# Altium schematic sheet 27-JTAG BUFFER.SchDoc
size 513 x 386 mm
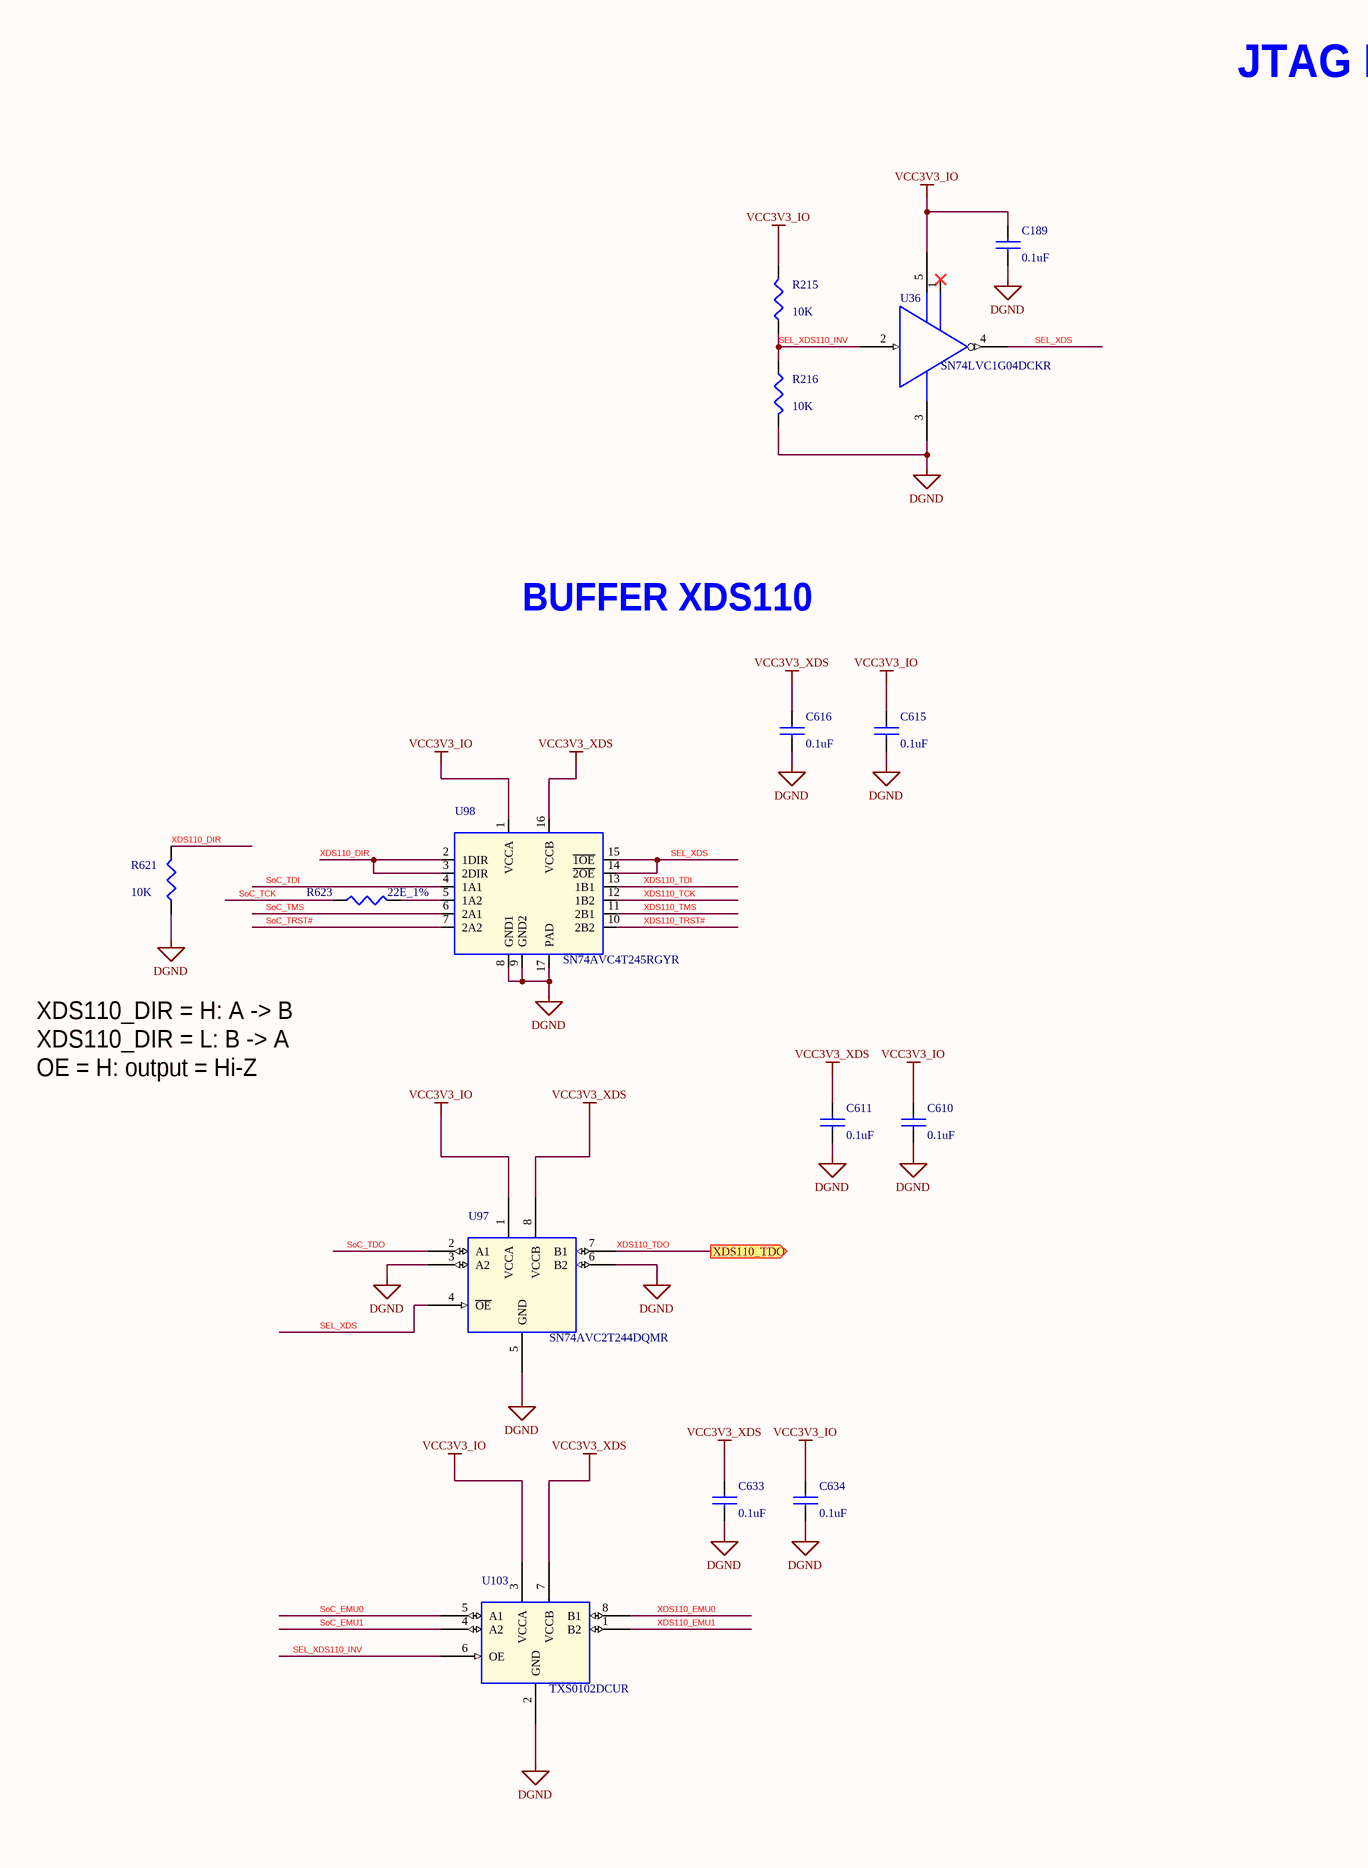
[diagram p0: 27-JTAG BUFFER.SchDoc, left]
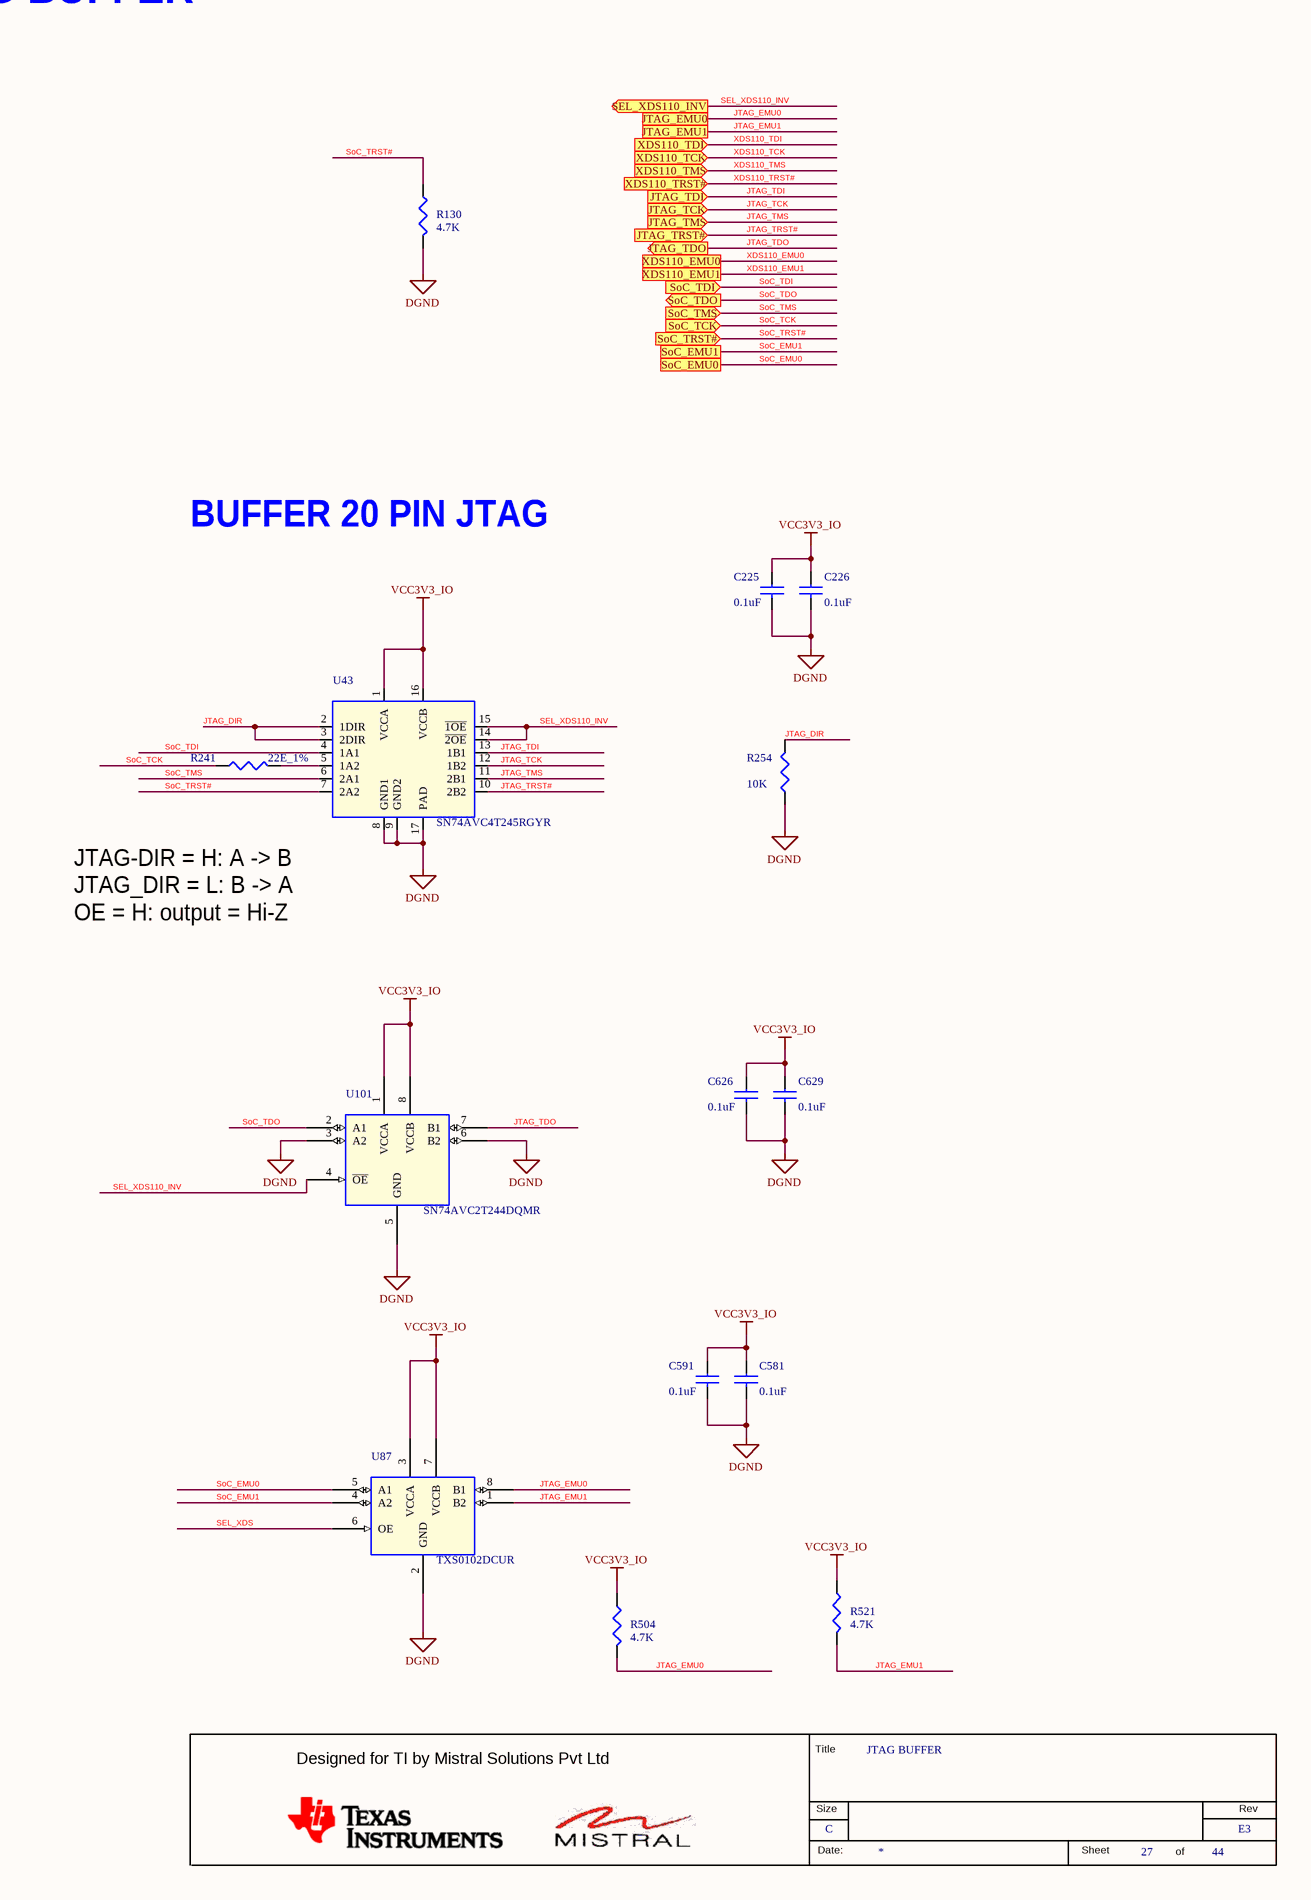
[diagram p1: 27-JTAG BUFFER.SchDoc, right]

## Parts
*  RevCode: E3  Title: JTAG BUFFER  Page Size: C  Page Number: 27  Page Count: 44  (hidden comment: MISTRAL_TITLEBLK_CSIZE)  (graphical)
C189  0.1uF  [CAP0201_0-5]
C225  0.1uF  [CAP0201_0-5]
C226  0.1uF  [CAP0201_0-5]
C581  0.1uF  [CAP0201_0-5]
C591  0.1uF  [CAP0201_0-5]
C610  0.1uF  [CAP0201_0-5]
C611  0.1uF  [CAP0201_0-5]
C615  0.1uF  [CAP0201_0-5]
C616  0.1uF  [CAP0201_0-5]
C626  0.1uF  [CAP0201_0-5]
C629  0.1uF  [CAP0201_0-5]
C633  0.1uF  [CAP0201_0-5]
C634  0.1uF  [CAP0201_0-5]
R130  4.7K  [RES0402]
R215  10K  [RES0402_0-5]
R216  10K  [RES0402_0-5]
R241  22E_1%  [RES0402]
R254  10K  [RES0402_0-5]
R504  4.7K  [RES0402]
R521  4.7K  [RES0402]
R621  10K  [RES0402_0-5]
R623  22E_1%  [RES0402]
U36  SN74LVC1G04DCKR  [SC70-5]
U43  SN74AVC4T245RGYR  [QFN16_19-68_160X140]
U87  TXS0102DCUR  [VSSOP8_19-68_85X95_0-9]
U97  SN74AVC2T244DQMR  [X2SON8_15-74_70X50]
U98  SN74AVC4T245RGYR  [QFN16_19-68_160X140]
U101  SN74AVC2T244DQMR  [X2SON8_15-74_70X50]
U103  TXS0102DCUR  [VSSOP8_19-68_85X95_0-9]

## Ports
JTAG_EMU0, JTAG_EMU1, JTAG_TCK (in), JTAG_TDI (in), JTAG_TDO (out), JTAG_TMS (in), JTAG_TRST# (in), SEL_XDS110_INV (out), SoC_EMU0, SoC_EMU1, SoC_TCK (in), SoC_TDI (in), SoC_TDO (out), SoC_TMS (in), SoC_TRST# (in), XDS110_EMU0, XDS110_EMU1, XDS110_TCK (in), XDS110_TDI (in), XDS110_TDO (out), XDS110_TMS (in), XDS110_TRST# (in)

## Nets
DGND: C189.2 C225.2 C226.2 C581.2 C591.2 C610.2 C611.2 C615.2 C616.2 C626.2 C629.2 C633.2 C634.2 R130.2 R216.2 R254.1 R621.1 U36.3(GND) U43.8(GND1) U43.9(GND2) U43.17(PAD) U87.2(GND) U97.3(A2) U97.5(GND) U97.6(B2) U98.8(GND1) U98.9(GND2) U98.17(PAD) U101.3(A2) U101.5(GND) U101.6(B2) U103.2(GND)
VCC3V3_IO: C189.1 C225.1 C226.1 C581.1 C591.1 C610.1 C615.1 C626.1 C629.1 C634.1 R215.2 R504.1 R521.1 U36.5(VCC) U43.1(VCCA) U43.16(VCCB) U87.3(VCCA) U87.7(VCCB) U97.1(VCCA) U98.1(VCCA) U101.1(VCCA) U101.8(VCCB) U103.3(VCCA)
VCC3V3_XDS: C611.1 C616.1 C633.1 U97.8(VCCB) U98.16(VCCB) U103.7(VCCB)
JTAG_DIR: R254.2 U43.2(1DIR) U43.3(2DIR)
JTAG_EMU0: R504.2 U87.8(B1) ; port JTAG_EMU0
JTAG_EMU1: R521.2 U87.1(B2) ; port JTAG_EMU1
JTAG_TCK: U43.12(1B2) ; port JTAG_TCK
JTAG_TDI: U43.13(1B1) ; port JTAG_TDI
JTAG_TDO: U101.7(B1) ; port JTAG_TDO
JTAG_TMS: U43.11(2B1) ; port JTAG_TMS
JTAG_TRST#: U43.10(2B2) ; port JTAG_TRST#
SEL_XDS: U36.4(Y) U87.6(OE) U97.4(~{OE}) U98.14(~{2OE}) U98.15(~{1OE})
SEL_XDS110_INV: R215.1 R216.1 U36.2(A) U43.14(~{2OE}) U43.15(~{1OE}) U101.4(~{OE}) U103.6(OE) ; port SEL_XDS110_INV
SoC_EMU0: U87.5(A1) U103.5(A1) ; port SoC_EMU0
SoC_EMU1: U87.4(A2) U103.4(A2) ; port SoC_EMU1
SoC_TCK: R241.2 R623.2 ; port SoC_TCK
SoC_TDI: U43.4(1A1) U98.4(1A1) ; port SoC_TDI
SoC_TDO: U97.2(A1) U101.2(A1) ; port SoC_TDO
SoC_TMS: U43.6(2A1) U98.6(2A1) ; port SoC_TMS
SoC_TRST#: R130.1 U43.7(2A2) U98.7(2A2) ; port SoC_TRST#
XDS110_DIR: R621.2 U98.2(1DIR) U98.3(2DIR)
XDS110_EMU0: U103.8(B1) ; port XDS110_EMU0
XDS110_EMU1: U103.1(B2) ; port XDS110_EMU1
XDS110_TCK: U98.12(1B2) ; port XDS110_TCK
XDS110_TDI: U98.13(1B1) ; port XDS110_TDI
XDS110_TDO: U97.7(B1) ; port XDS110_TDO
XDS110_TMS: U98.11(2B1) ; port XDS110_TMS
XDS110_TRST#: U98.10(2B2) ; port XDS110_TRST#
NetR241_1: R241.1 U43.5(1A2)
NetR623_1: R623.1 U98.5(1A2)

Not connected (* = marked no-connect by the designer): U36 1(NC)*

## Notes on the sheet
- JTAG BUFFER
- BUFFER XDS110
- BUFFER 20 PIN JTAG
- (near U43) JTAG-DIR = H: A -> B
  JTAG_DIR = L: B -> A
  OE = H: output = Hi-Z
- XDS110_DIR = H: A -> B
  XDS110_DIR = L: B -> A
  OE = H: output = Hi-Z
- (in symbol MISTRAL_TITLEBLK_CSIZE) Title; Designed for TI by Mistral Solutions Pvt Ltd; Size; Rev; Date:; Sheet; of

## Library data of the parts
* = MISTRAL_TITLEBLK_CSIZE: Issue: 1.0; Page Create Date: March  8, 1995; Page Modify Date: *
C189 C226 C581 C615 C629 = CAP_Dup5: CAP CERAMIC 0.1uF 16V 10% X5R 0201; Part_type: CAPACITORS\CERAMIC; Mfr_part_number: GRM033R61C104KE84J; Mfr_name: MURATA; Mistral Part No: 120009030072-R; Custom_Duty: 15%; Customs_HS_Code: 85322990; Wattage: NA; Project: TI_MAXIE_CPB; Library Ref: CAP; PCB Footprint: CAP0201_0-5; MECHANICAL 3D STEP FILE: CAP0201_0-5; Chkd/date: MANIRAJA/120218; Crtd /date: MANIRAJA/120218; Datasheet: Y:\MIS_DATABASE\DATASHEETS\CAPACITORS\GRM033R61C104KE84.PDF; Temperature: -55°C+85°C; Weight: 0.33mg; Height: 0.33MM; Distributor_part_number: 490-16742-1-ND; Distributor_name: DIGIKEY; Package: 0201; Voltage: 16V; Tolerance: 10%
C225 C591 C610 C611 C616 C626 C633 C634 = CAP_Dup5: CAP CERAMIC 0.1uF 16V 10% X5R 0201; Mistral Part No: 120009030072-R; Mfr_name: MURATA; Mfr_part_number: GRM033R61C104KE84J; Part_type: CAPACITORS\CERAMIC; Project: TI_MAXIE_CPB; Wattage: NA; Customs_HS_Code: 85322990; Custom_Duty: 15%; Library Ref: CAP; PCB Footprint: CAP0201_0-5; Tolerance: 10%; Voltage: 16V; Package: 0201; Distributor_name: DIGIKEY; Distributor_part_number: 490-16742-1-ND; Height: 0.33MM; Weight: 0.33mg; Temperature: -55°C+85°C; Datasheet: Y:\MIS_DATABASE\DATASHEETS\CAPACITORS\GRM033R61C104KE84.PDF; Crtd /date: MANIRAJA/120218; Chkd/date: MANIRAJA/120218; MECHANICAL 3D STEP FILE: CAP0201_0-5
R130 R504 R521 = RESISTOR_Dup3: RES 4.7K 1/16W 5% 0402; Part_type: RESISTORS\FIXED; Mfr_part_number: RC0402JR-074K7L; Mfr_name: YAGEO AMERICA; Mistral Part No: 110009030792-R; Custom_Duty: 15%; Customs_HS_Code: 85332119; Voltage: NA; Project: TMDXCSK368; Library Ref: RESISTOR; PCB Footprint: RES0402; Chkd/date: VASANTHA/130516; Crtd /date: VASANTHA/130516; Datasheet: Y:\MIS_DATABASE\DATASHEETS\RESISTORS\YAGEO-RC0402.PDF; Temperature: -55°C+155°C; Weight: NA; Height: 0.55MM; Distributor_part_number: 311-4.7KJRCT-ND; Distributor_name: DIGIKEY; Package: 0402; Wattage: 1/16W; Tolerance: 5%
R215 R254 R621 = RESISTOR_Dup5: RES 10K 1/16W 5% 0402; Mistral Part No: 110009030208-R; Mfr_name: YAGEO AMERICA; Mfr_part_number: RC0402JR-0710KL; Part_type: RESISTORS\FIXED; Project: HSE; Voltage: NA; Customs_HS_Code: 85332119; Custom_Duty: 15%; Footprint Path: Y:\MIS_DATABASE\Library\ALTIUM_TOOL\PCB_FOOTPRINTS\Altium_Footprint_Lib.PcbLib; Library Path: Y:\MIS_DATABASE\Library\ALTIUM_TOOL\SCHEMATICS_PARTS\MS_DISCRETE_Library.schlib; Footprint Ref: RES0402_0-5; Library Ref: RESISTOR; PCB Footprint: RES0402_0-5; Tolerance: 5%; Wattage: 1/16W; Package: 0402; Distributor_name: DIGIKEY; Distributor_part_number: 311-10KJRCT-ND; Height: 0.40MM; Weight: 0.65mg; Temperature: -55°C+155°C; Datasheet: Y:\MIS_DATABASE\DATASHEETS\RESISTORS\YAGEO-RC0402.PDF; Crtd /date: MAZHAR/230805; Chkd/date: VASANTHA/061216; RoHS: Pb-Free; MECHANICAL 3D STEP FILE: RES0402_0-5
R216 = RESISTOR_Dup5: RES 10K 1/16W 5% 0402; Mistral Part No: 110009030208-R; Mfr_name: YAGEO AMERICA; Mfr_part_number: RC0402JR-0710KL; Part_type: RESISTORS\FIXED; Project: HSE; Voltage: NA; Customs_HS_Code: 85332119; Custom_Duty: 15%; NI_MARK: DNI; Footprint Path: Y:\MIS_DATABASE\Library\ALTIUM_TOOL\PCB_FOOTPRINTS\Altium_Footprint_Lib.PcbLib; Library Path: Y:\MIS_DATABASE\Library\ALTIUM_TOOL\SCHEMATICS_PARTS\MS_DISCRETE_Library.schlib; Footprint Ref: RES0402_0-5; Library Ref: RESISTOR; Tolerance: 5%; Wattage: 1/16W; Package: 0402; Distributor_name: DIGIKEY; Distributor_part_number: 311-10KJRCT-ND; Height: 0.40MM; Weight: 0.65mg; Temperature: -55°C+155°C; Datasheet: Y:\MIS_DATABASE\DATASHEETS\RESISTORS\YAGEO-RC0402.PDF; Crtd /date: MAZHAR/230805; Chkd/date: VASANTHA/061216; RoHS: Pb-Free; MECHANICAL 3D STEP FILE: RES0402_0-5; PCB Footprint: RES0402_0-5
R241 = RESISTOR_Dup4: RES 22E 1/16W 1% 0402; Mistral Part No: 110009090004-P; Mfr_name: YAGEO AMERICA; Mfr_part_number: RC0402FR-0722RL; Part_type: RESISTORS\FIXED; Alternate_mfr_name_A: VISHAY; Alternate_mfr_part_number_A: CRCW040222R0FKED; Cust_part_number: 4700-80047E; SIGNAL_MODEL: RESISTOR_RES0402_22E_22E; Project: VMEFMCD; Voltage: 50V; Customs_HS_Code: 85332119; Custom_Duty: 15%; Remarks: In alternate datasheet it is RoHS COMPLIANT. Y:\MIS_DATABASE\DATASHEETS\RESISTORS\CRCW0402.PDF; Library Ref: RESISTOR; Tolerance: 1%; Wattage: 1/16W; Package: 0402; Distributor_name: DIGIKEY; Distributor_part_number: 311-22.0LRCT-ND; Distributor_name_A: DIGIKEY; Distributor_part_number_A: 541-22.0LCT-ND; Height: 0.40MM; Weight: 0.8g/1000pcs; Temperature: -55°C+155°C; Datasheet: Y:\MIS_DATABASE\DATASHEETS\RESISTORS\YAGEO-RC0402.PDF; Crtd /date: MAZHAR/090909; Chkd/date: SUHAS/290910; RoHS: Pb-Free; PCB Footprint: RES0402
R623 = RESISTOR_Dup4: RES 22E 1/16W 1% 0402; Cust_part_number: 4700-80047E; Alternate_mfr_part_number_A: CRCW040222R0FKED; Alternate_mfr_name_A: VISHAY; Part_type: RESISTORS\FIXED; Mfr_part_number: RC0402FR-0722RL; Mfr_name: YAGEO AMERICA; Mistral Part No: 110009090004-P; Remarks: In alternate datasheet it is RoHS COMPLIANT. Y:\MIS_DATABASE\DATASHEETS\RESISTORS\CRCW0402.PDF; Custom_Duty: 15%; Customs_HS_Code: 85332119; Voltage: 50V; Project: VMEFMCD; SIGNAL_MODEL: RESISTOR_RES0402_22E_22E; Library Ref: RESISTOR; RoHS: Pb-Free; Chkd/date: SUHAS/290910; Crtd /date: MAZHAR/090909; Datasheet: Y:\MIS_DATABASE\DATASHEETS\RESISTORS\YAGEO-RC0402.PDF; Temperature: -55°C+155°C; Weight: 0.8g/1000pcs; Height: 0.40MM; Distributor_part_number_A: 541-22.0LCT-ND; Distributor_name_A: DIGIKEY; Distributor_part_number: 311-22.0LRCT-ND; Distributor_name: DIGIKEY; Package: 0402; Wattage: 1/16W; Tolerance: 1%; PCB Footprint: RES0402
U36 = SN74LVC1G04DCKR_SC70-5: IC SINGLE INVERTER GATE SC70-5; Mistral Part No: 141009070007-R; Mfr_name: TEXAS INSTRUMENTS; Part_type: ICS\DIGITAL\GATES; Project: BUG_BASE-II; Customs_HS_Code: 85423100; Custom_Duty: 15%; Library Ref: SN74LVC1G04DCKR_SC70-5; PCB Footprint: SC70-5; Mfr_part_number: SN74LVC1G04DCKR; Package: SC70-5; Distributor_name: DIGIKEY; Distributor_part_number: 296-11600-1-ND; Height: 1.10MM; Temperature: -40°C+85°C; Datasheet: Y:\MIS_DATABASE\DATASHEETS\ICS\DIGITAL\GATES\SN74LVC1G04-1.PDF; Crtd /date: USMAN/150709; Chkd/date: SUHAS/221010; RoHS: Sb/ Br FREE
U43 = SN74AVC4T245RGYR_QFN16: IC 4-BIT DUAL SUPPLY BUS TRANSCEIVER QFN16; Part_type: ICS\DIGITAL\COMBINATIONAL; Mfr_name: TEXAS INSTRUMENTS; Mistral Part No: 141009030112-R; Custom_Duty: 15%; Customs_HS_Code: 85423100; Project: HS100RD; Library Ref: SN74AVC4T245RGYR_QFN16; PCB Footprint: QFN16_19-68_160X140; RoHS: Sb/ Br FREE; Chkd/date: MAZHAR/060308; Crtd /date: USMAN/060308; Datasheet: Y:\MIS_DATABASE\DATASHEETS\ICS\DIGITAL\BUSTRANSCEIVER\SN74AVC4T245XXXX.PDF; Height: 1.00MM; Distributor_part_number: 296-18231-1-ND; Distributor_name: DIGIKEY; Package: QFN16; Mfr_part_number: SN74AVC4T245RGYR
U87 = TXS0102DCUR_VSSOP8: IC 2BIT BI-DIR VOLTAGE-LEVEL TRANSLATOR US8(VSSOP8); Part_type: ICS\INTERFACE\LEVEL TRANSLATOR; Mfr_name: TEXAS INSTRUMENTS; Mistral Part No: 141009030376-R; Custom_Duty: 15%; Customs_HS_Code: 85423100; Wattage: NA; Project: SD_WATERLOO; Footprint Ref: VSSOP8_19-68_85X95_0-9; Library Ref: TXS0102DCUR_VSSOP8; PCB Footprint: VSSOP8_19-68_85X95_0-9; Footprint Path: Y:\MIS_DATABASE\Library\ALTIUM_TOOL\PCB_FOOTPRINTS\Altium_Footprint_Lib.PcbLib; Library Path: Y:\MIS_DATABASE\Library\ALTIUM_TOOL\SCHEMATICS_PARTS\MS_MISCINTERFACE_Library.schlib; MECHANICAL 3D STEP FILE: VSSOP8_19-68_85X95_0-9; Chkd/date: MANIRAJA/130617; Crtd /date: SHREESHAIL/190108; Datasheet: Y:\MIS_DATABASE\DATASHEETS\ICS\INTERFACE\TXS0102.PDF; Temperature: -40°C+85°C; Weight: 9.6mg; Height: 0.90MM; Distributor_part_number: 296-21931-1-ND; Distributor_name: DIGIKEY; Package: US8; Voltage: NA; Tolerance: NA; Mfr_part_number: TXS0102DCUR
U97 U101 = SN74AVC2T244DQMR_X2SON8: IC 2-BIT UNDIRECTIONAL VOLTAGE-LEVEL TRANSLATOR X2SON8; Mistral Part No: 141016030002-R; Mfr_name: TEXAS INSTRUMENTS; Part_type: ICS\INTERFACE\LEVEL TRANSLATOR; Project: OCTASIC_3600; Tolerance: NA; Pb-Free: 85423100; Customs_HS_Code: 15%; Library Ref: SN74AVC2T244DQMR_X2SON8; PCB Footprint: X2SON8_15-74_70X50; Mfr_part_number: SN74AVC2T244DQMR; Voltage: NA; Wattage: NA; Package: X2SON8; Distributor_name: DIGIKEY; Distributor_part_number: 296-29674-1-ND; Height: 0.40MM; Weight: NA; Temperature: -40°C+85°C; Datasheet: Y:\MIS_DATABASE\DATASHEETS\ICS\INTERFACE\SN74AVC2T244.PDF; Crtd /date: VASANTHA/030316; Chkd/date: VASANTHA/060516
U98 = SN74AVC4T245RGYR_QFN16: IC 4-BIT DUAL SUPPLY BUS TRANSCEIVER QFN16; Mistral Part No: 141009030112-R; Mfr_name: TEXAS INSTRUMENTS; Part_type: ICS\DIGITAL\COMBINATIONAL; Project: HS100RD; Customs_HS_Code: 85423100; Custom_Duty: 15%; Library Ref: SN74AVC4T245RGYR_QFN16; PCB Footprint: QFN16_19-68_160X140; Mfr_part_number: SN74AVC4T245RGYR; Package: QFN16; Distributor_name: DIGIKEY; Distributor_part_number: 296-18231-1-ND; Height: 1.00MM; Datasheet: Y:\MIS_DATABASE\DATASHEETS\ICS\DIGITAL\BUSTRANSCEIVER\SN74AVC4T245XXXX.PDF; Crtd /date: USMAN/060308; Chkd/date: MAZHAR/060308; RoHS: Sb/ Br FREE
U103 = TXS0102DCUR_VSSOP8: IC 2BIT BI-DIR VOLTAGE-LEVEL TRANSLATOR US8(VSSOP8); Mistral Part No: 141009030376-R; Mfr_name: TEXAS INSTRUMENTS; Part_type: ICS\INTERFACE\LEVEL TRANSLATOR; Project: SD_WATERLOO; Tolerance: NA; Customs_HS_Code: 85423100; Custom_Duty: 15%; Footprint Ref: VSSOP8_19-68_85X95_0-9; Library Ref: TXS0102DCUR_VSSOP8; PCB Footprint: VSSOP8_19-68_85X95_0-9; Mfr_part_number: TXS0102DCUR; Voltage: NA; Wattage: NA; Package: US8; Distributor_name: DIGIKEY; Distributor_part_number: 296-21931-1-ND; Height: 0.90MM; Weight: 9.6mg; Temperature: -40°C+85°C; Datasheet: Y:\MIS_DATABASE\DATASHEETS\ICS\INTERFACE\TXS0102.PDF; Crtd /date: SHREESHAIL/190108; Chkd/date: MANIRAJA/130617; MECHANICAL 3D STEP FILE: VSSOP8_19-68_85X95_0-9; Library Path: Y:\MIS_DATABASE\Library\ALTIUM_TOOL\SCHEMATICS_PARTS\MS_MISCINTERFACE_Library.schlib; Footprint Path: Y:\MIS_DATABASE\Library\ALTIUM_TOOL\PCB_FOOTPRINTS\Altium_Footprint_Lib.PcbLib